# Altium schematic sheet Main Board.SchDoc
size A; SheetNumber: 3; SheetTotal: 3
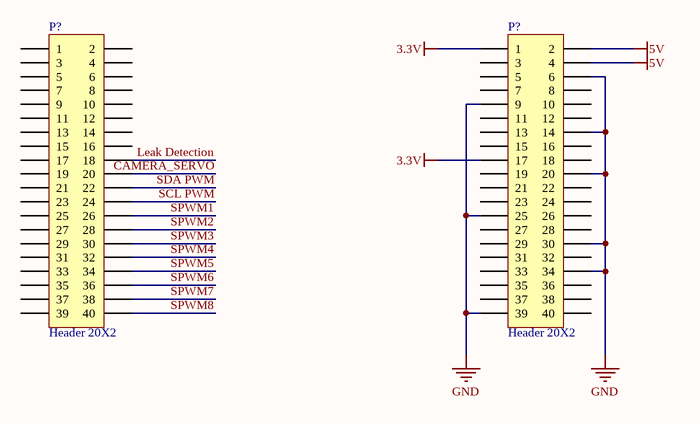
[diagram p0: Main Board.SchDoc]

## Parts
(Parts that share a designator on the sheet are numbered #1, #2 ... from top to bottom, then left to right.)
P?#1  Header 20X2  [HDR2X20]
P?#2  Header 20X2  [HDR2X20]

## Nets
3.3V: P?#2.1 P?#2.17
5V: P?#2.2 P?#2.4
GND: P?#2.6 P?#2.9 P?#2.14 P?#2.20 P?#2.25 P?#2.30 P?#2.34 P?#2.39
CAMERA_SERVO: P?#1.20
Leak Detection: P?#1.18
SCL PWM: P?#1.24
SDA PWM: P?#1.22
SPWM1: P?#1.26
SPWM2: P?#1.28
SPWM3: P?#1.30
SPWM4: P?#1.32
SPWM5: P?#1.34
SPWM6: P?#1.36
SPWM7: P?#1.38
SPWM8: P?#1.40

Not connected (* = marked no-connect by the designer): P?#1 1 2 3 4 5 6 7 8 9 10 11 12 13 14 15 16 17 19 21 23 25 27 29 31 33 35 37 39; P?#2 3 5 7 8 10 11 12 13 15 16 18 19 21 22 23 24 26 27 28 29 31 32 33 35 36 37 38 40

## Library data of the parts
P?#1 P?#2 = Header 20X2: Header, 20-Pin, Dual row; LatestRevisionDate: 17-Jul-2002; LatestRevisionNote: Re-released for DXP Platform.; Publisher: Altium Limited